# Altium schematic sheet coaxial-port.SchDoc
size A
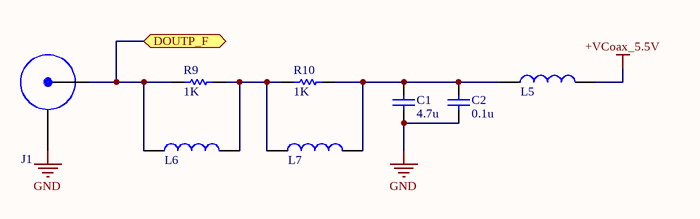
[diagram p0: coaxial-port.SchDoc]

## Parts
C1  value 4.7u  [Cap-0603]  (hidden comment: X7R Ceramic)
C2  value 0.1u  [Cap-0603]  (hidden comment: X7R Ceramic)
J1  Coax Connector  [SMA_132134-10-ND]  (value not drawn)
L5  Ferrite Bead  [BLM18KG601SN1D]  (value not drawn)
L6  Ferrite Bead  [CIG21L4R7MNE]  (value not drawn)
L7  Ferrite Bead  [CBC3225T101MR]  (value not drawn)
R9  value 1K  [Res_0402]  (hidden comment: Res1)
R10  value 1K  [Res_0402]  (hidden comment: Res1)

## Ports
DOUTP_F (bidir)

## Nets
+VCoax_5.5V: L5.2
GND: C1.1 C2.1 J1.1
DOUTP_F: J1.0 L6.1 R9.2 ; port DOUTP_F
NetC1_2: C1.2 C2.2 L5.1 L7.2 R10.1
NetL6_2: L6.2 L7.1 R9.1 R10.2

## Library data of the parts
C1 C2 = Cap: Capacitor; Published: 8-Jun-2000; LatestRevisionDate: 17-Jul-2002; LatestRevisionNote: Re-released for DXP Platform.; PackageReference: RAD-0.3; Publisher: Altium Limited; PackageDescription: Radial Cap, Thru-Hole; 2 Leads; 0.3 in Pin Spacing
R9 R10 = Res1: Resistor; Published: 8-Jun-2000; LatestRevisionDate: 17-Jul-2002; LatestRevisionNote: Re-released for DXP Platform.; PackageReference: AXIAL-0.3; Publisher: Altium Limited; PackageDescription: Axial Device, Thru-Hole; 2 Leads; 0.3 in Pin Spacing